# EAGLE design I2C-Oled-Backpack-EastRising (EAGLE 9.5.2)
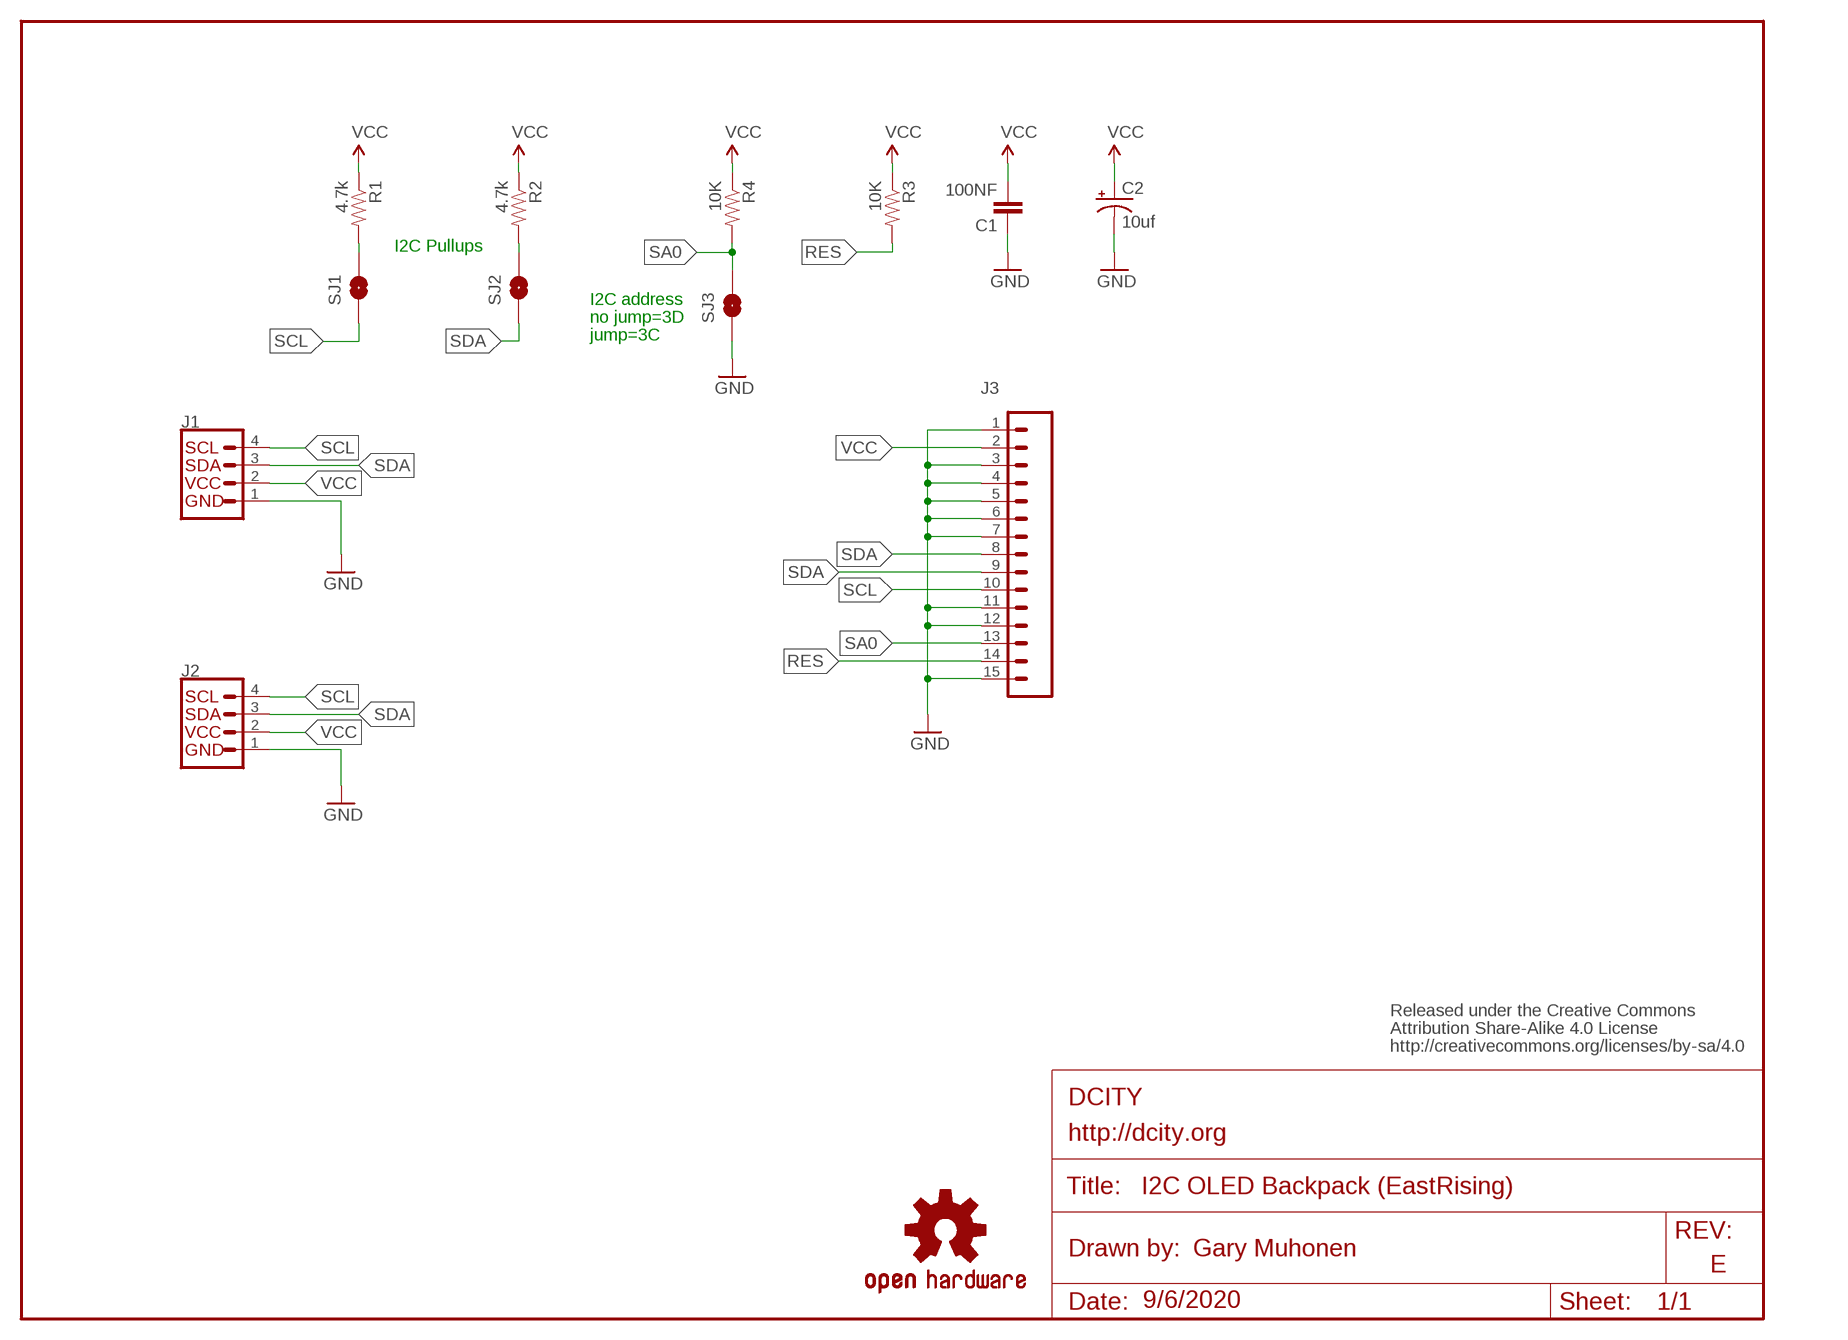
[diagram p0: schematic, sheet 1]
U$1 (DOCFIELD-WHT): COMPANYNAME: DCITY; COMPANYWEBSITE: http://dcity.org; DATE: 9/6/2020; DRAWNBY: Gary Muhonen; TITLE: I2C OLED Backpack (EastRising); VERSION: E

## Parts
C1  100NF  CAP0805  [0805-CAP]
C2  10uf  CAP_POL0805  [0805-POL]
J1  QWIIC_RIGHT_ANGLE  QWIIC_CONNECTORJS-1MM  [JST04_1MM_RA]
J2  QWIIC_RIGHT_ANGLE  QWIIC_CONNECTORJS-1MM  [JST04_1MM_RA]
J3  15P-2.54  M15LOCK  [1X15_LOCK]
LOGO1  OSHW-LOGOS  [OSHW-LOGO-S]
R1  4.7k  RESISTOR0805  [0805-RES]
R2  4.7k  RESISTOR0805  [0805-RES]
R3  10K  RESISTOR0805  [0805-RES]
R4  10K  RESISTOR0805  [0805-RES]
SJ1  SOLDERJUMPERNC  [SJ_2S]
SJ2  SOLDERJUMPERNC  [SJ_2S]
SJ3  SOLDERJUMPERNC  [SJ_2S]
U$2  CREATIVE_COMMONS  [CREATIVE_COMMONS]

## Nets
GND: C1.1 C2.- J1.1 J2.1 J3.1 J3.3 J3.4 J3.5 J3.6 J3.7 J3.11 J3.12 J3.15 SJ3.1
N$1: R1.2 SJ1.2
N$2: R2.2 SJ2.2
RES: J3.14 R3.2
SA0: J3.13 R4.2 SJ3.2
SCL: J1.4 J2.4 J3.10 SJ1.1
SDA: J1.3 J2.3 J3.8 J3.9 SJ2.1
VCC: C1.2 C2.+ J1.2 J2.2 J3.2 R1.1 R2.1 R3.1 R4.1

## Notes on the sheet
- I2C Pullups
- I2C address
- no jump=3D
- jump=3C

## Library data of the parts
C1 = 0:CAP: Capacitor Standard 0603 ceramic capacitor, and 0.1" leaded capacitor.
C2 = 0:CAP_POL: Capacitor Polarized These are standard SMD and PTH capacitors. Normally 10uF, 47uF, and 100uF in electrolytic and tantalum varieties. Always verify the external diameter of the through hole cap, it varies with capacity, voltage, and manufacturer. The EIA devices should be standard.
J1 J2 = 0:QWIIC_CONNECTOR: SparkFun I2C Standard Qwiic Connector An SMD 1mm pitch JST connector makes it easy and quick (get it? Qwiic?) to connect I2C devices to each other. The Qwiic system <http://www.sparkfun.com/qwiic> enables fast and solderless connection between popular platforms and various sensors and actuators. We carry 200mm <https://www.sparkfun.com/products/14204>, 100mm <https://www.sparkfun.com/products/14205>, 50mm <https://www.sparkfun.com/products/14206>, and breadboard friendly <https://www.sparkfun.com/products/14207> Qwiic cables. We also offer 10 pcs strips <https://www.sparkfun.com/products/14323> the SMD connectors.; PROD_ID: CONN-13694
J3 = 0:M15
LOGO1 = 0 - Seeedstudio:OSHW-LOGO: Open Source Hardware Logo This logo indicates the piece of hardware it is found on incorporates a OSHW license and/or adheres to the definition of open source hardware found here: http://freedomdefined.org/OSHW
R1-R4 = 0:RESISTOR: Resistor Basic schematic elements and footprints for 0603, 1206, and PTH 1/10th watt (small) resistors.
SJ1-SJ3 = 0:SOLDERJUMPER: Solder Jumper Standard SMD solder jumper. Used to automate production. Two varients : Normally Open and Normally Closed are the same, but have different paste layers. NC will have a large amount of paste and should jumper during reflow.
U$2 = 0:CREATIVE_COMMONS

## Board
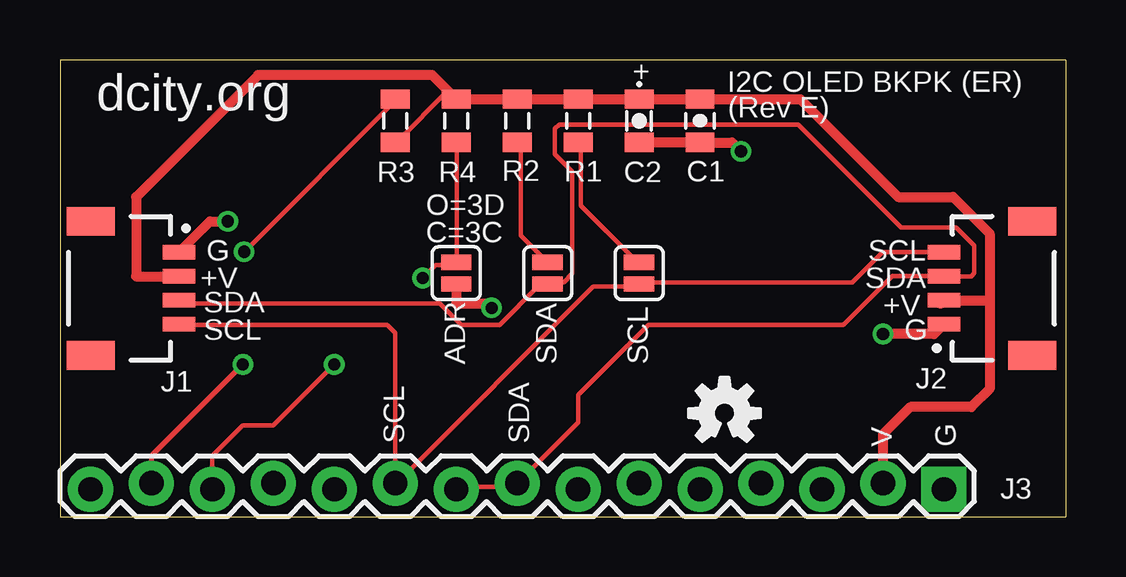
[diagram p1: board, top side]
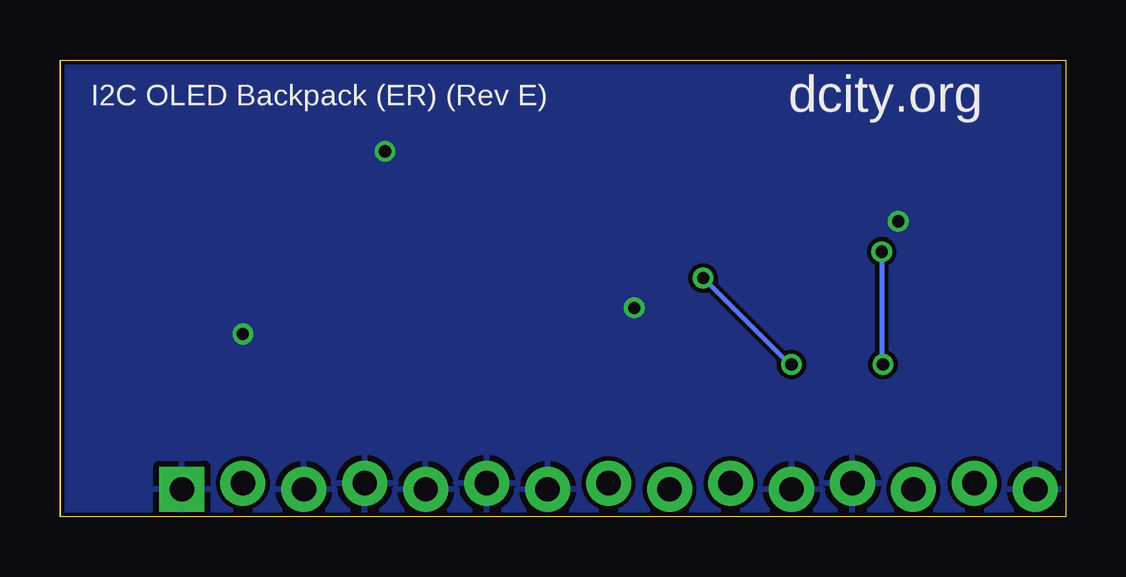
[diagram p2: board, bottom side, seen from below]

Size 41.91 x 19.05 mm. Coordinates in mm from the lower left corner, seen from the top.
Outline: 0,0 41.91,0 41.91,19.05 0,19.05 0,0
Copper layers (1*16): Top 0.035mm / dielectric 1.5mm / Bottom 0.035mm
Design rules "7mils-gary": minimum track width 7mil, minimum drill 20mil, track to track 7mil, track to pad 7mil, pad to pad 7mil, via to via 7mil, smd to smd 7mil, copper to edge 7mil, drill to drill 7mil, minimum pad ring 7mil, minimum via ring 7mil, stop-mask expansion 4mil, vias tented up to drill 25mil, thermal gap 10mil
vRestrict: area 13.1,13.8 to 14.7,15; area 15.6,13.8 to 17.2,15.1; area 18.2,13.7 to 19.8,15; area 20.8,13.8 to 22.4,15.1; area 23.3,13.6 to 25,15; area 26,13.7 to 27.5,15; area 27.6,12.4 to 30,13.9; area 27.5,10.5 to 30,11.8; area 28.2,8.5 to 30.1,9.8; area 28.7,6.5 to 30.2,7.9; area 23.4,6.1 to 24.8,8.8; area 19.7,6.1 to 20.9,8.8; 11 more areas

### Footprints (pad centres in the part's own frame; a part is rotated, then mirrored left to right if it is on the bottom)
0805-CAP = smd 0.8 x 1.2: 1 -0.9,0; 2 0.9,0
0805-POL = smd 0.8 x 1.2: + 0.9,0; - -0.9,0
JST04_1MM_RA = smd 0.6 x 1.35: 1 -1.5,0; 2 -0.5,0; 3 0.5,0; 4 1.5,0 | smd 1.2 x 2: NC1 2.8,-3.675; NC2 -2.8,-3.675
1X15_LOCK = drill 1.016 pad 1.88 square: 1 0,0.127 | drill 1.016 pad 1.88: 2 2.54,-0.127; 3 5.08,0.127; 4 7.62,-0.127; 5 10.16,0.127; 6 12.7,-0.127; 7 15.24,0.127; 8 17.78,-0.127; 9 20.32,0.127; 10 22.86,-0.127; 11 25.4,0.127; 12 27.94,-0.127; 13 30.48,0.127; 14 33.02,-0.127; 15 35.56,0.127
0805-RES = smd 0.8 x 1.2: 1 -0.9,0; 2 0.9,0
SJ_2S = smd 0.635 x 1.27: 1 -0.45,0; 2 0.45,0

### Placement (x,y rotation side)
C1  26.67,16.51 90 top
C2  24.13,16.51 90 top
J1  4.95,9.53 270 top
J2  36.83,9.53 90 top
J3  36.83,1.27 180 top
LOGO1  27.69,4.32 0 top
R1  21.59,16.51 270 top
R2  19.05,16.51 270 top
R3  13.97,16.51 90 top
R4  16.51,16.51 270 top
SJ1  24.13,10.16 90 top
SJ2  20.32,10.16 90 top
SJ3  16.51,10.16 90 top
U$2  0,20.32 0 top

### Tracks (layer width: path | path; a pad name or v marks a point on that pad's centre or on a via)
GND  (via drill 0.51)
  Top 0.406: SJ3.1 16.51,8.89 17.8,8.89 v17.98,8.71 | v28.37,15.24 28,15.61 C1.1 C2.- | J1.1 6.25,12.32 v6.99,12.32 | J2.1 36.42,7.62 v34.29,7.62
  pour Bottom: 0,0 41.91,0 41.91,19.05 0,19.05
N$1
  Top 0.178: R1.2 21.69,15.47 21.69,12.98 24,10.67 SJ1.2
N$2
  Top 0.178: R2.2 19.2,15.47 19.2,11.73 20.27,10.67 SJ2.2
RES  (via drill 0.51)
  Top 0.178: v7.67,11.05 14.03,17.41 R3.2
  Top 0.2: v7.62,6.35 3.81,2.54 J3.14
  Bottom 0.178: 3.91,1.42 J3.14
  Bottom 0.2: v7.67,11.05 7.67,6.4 v7.62,6.35
SA0  (via drill 0.51)
  Top 0.178: R4.2 16.54,15.47 16.54,10.67 SJ3.2 16.36,10.49 15.65,10.49 v15.11,9.96 | v11.43,6.35 8.89,3.81 7.62,3.81 6.35,2.54 J3.13
  Bottom 0.178: v15.11,9.96 11.51,6.35 v11.43,6.35
SCL
  Top 0.178: J2.4 36.81,11.05 34.29,11.05 33.02,9.78 24.18,9.78 SJ1.1 24,9.6 22.23,9.6 14.05,1.42 J3.10 13.97,7.67 13.64,8 4.98,8 J1.4 4.98,8
SDA
  Top 0.178: 19.91,9.6 20.27,9.6 SJ2.1 | 19.91,1.42 19.2,1.42 J3.8 | J3.9 16.54,1.25 19.02,1.25 J3.8 | SJ2.1 20.45,9.78 20.98,9.78 21.34,10.13 21.34,14.4 20.62,15.11 20.62,16.18 20.8,16.36 30.76,16.36 35.05,12.06 37.34,12.06 38.1,11.3 38.1,10.16 37.97,10.03 J2.3 34.67,10.03 32.64,8 24.51,8 21.59,5.08 21.59,3.94 J3.8 | 4.98,9.05 J1.3 4.98,8.89 15.82,8.89 16.71,8 18.31,8 19.91,9.6 | 19.91,9.6 SJ2.1
VCC
  Top 0.178: R3.1 14.05,15.65 16.18,17.78 R4.1
  Top 0.406: 36.7,8.89 J2.2 36.84,9.02 38.73,9.02 | 38.73,9.02 38.73,11.81 37.21,13.34 34.92,13.34 30.85,17.41 C1.2 C2.+ R1.1 R2.1 R4.1 15.51,18.41 8.26,18.41 3.17,13.34 3.17,10.03 3.18,10.03 J1.2 | 38.73,9.02 38.73,5.33 37.97,4.57 35.43,4.57 34.29,3.43 J3.2

### Text on the board
tPlace: + | I2C OLED BKPK (ER) | dcity.org | (Rev E) | O=3D | G | C=3C | SCL | +V | SDA | SDA | +V | SCL | G | ADR | SDA | SCL | SCL | SDA | V | G
bPlace: dcity.org | I2C OLED Backpack (ER) (Rev E)